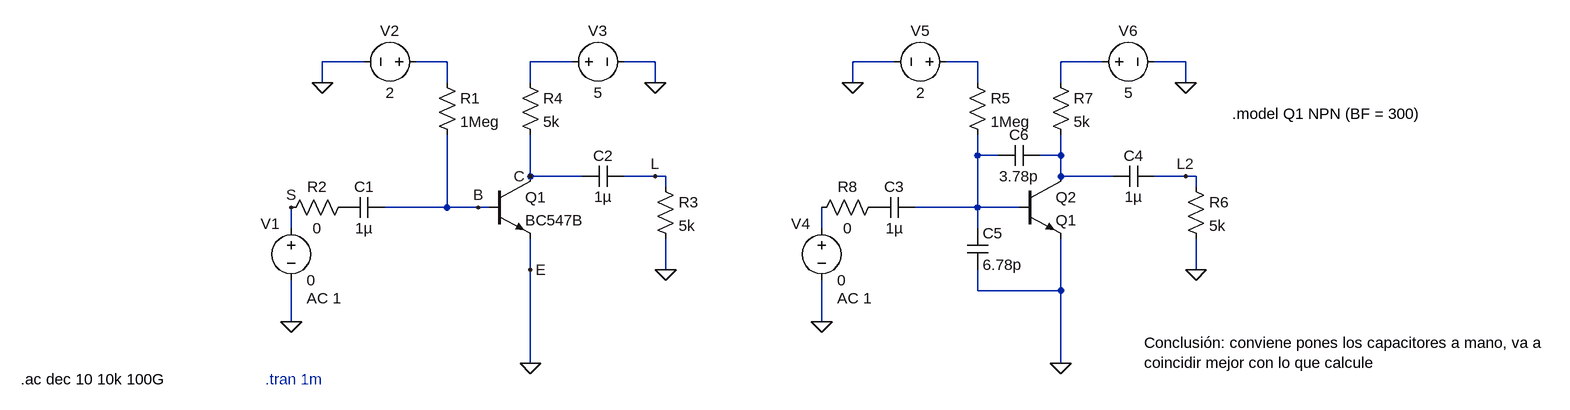
[diagram p0: schematic Simu en altas frec.asc]
Simu en altas frec.asc, the LTspice schematic file:
Version 4
SHEET 1 2168 680
WIRE 304 112 240 112
WIRE 432 112 384 112
WIRE 624 112 560 112
WIRE 752 112 704 112
WIRE 1120 112 1056 112
WIRE 1248 112 1200 112
WIRE 1440 112 1376 112
WIRE 1568 112 1520 112
WIRE 240 144 240 112
WIRE 432 144 432 112
WIRE 560 144 560 112
WIRE 752 144 752 112
WIRE 1056 144 1056 112
WIRE 1248 144 1248 112
WIRE 1376 144 1376 112
WIRE 1568 144 1568 112
WIRE 1248 256 1248 224
WIRE 1280 256 1248 256
WIRE 1376 256 1376 224
WIRE 1376 256 1344 256
WIRE 560 288 560 224
WIRE 640 288 560 288
WIRE 752 288 704 288
WIRE 768 288 752 288
WIRE 1376 288 1376 256
WIRE 1456 288 1376 288
WIRE 1568 288 1520 288
WIRE 1584 288 1568 288
WIRE 768 304 768 288
WIRE 1584 304 1584 288
WIRE 432 336 432 224
WIRE 432 336 336 336
WIRE 480 336 432 336
WIRE 496 336 480 336
WIRE 1248 336 1248 256
WIRE 1248 336 1152 336
WIRE 1312 336 1248 336
WIRE 192 368 192 336
WIRE 1008 368 1008 336
WIRE 1248 368 1248 336
WIRE 560 432 560 384
WIRE 768 432 768 384
WIRE 1584 432 1584 384
WIRE 1248 464 1248 432
WIRE 1376 464 1376 384
WIRE 1376 464 1248 464
WIRE 192 512 192 448
WIRE 1008 512 1008 448
WIRE 560 576 560 432
WIRE 1376 576 1376 464
FLAG 560 576 0
FLAG 768 432 0
FLAG 192 512 0
FLAG 240 144 0
FLAG 752 144 0
FLAG 480 336 B
FLAG 560 288 C
FLAG 560 432 E
FLAG 752 288 L
FLAG 192 336 S
FLAG 1376 576 0
FLAG 1584 432 0
FLAG 1008 512 0
FLAG 1056 144 0
FLAG 1568 144 0
FLAG 1568 288 L2
SYMBOL res 416 128 R0
SYMATTR InstName R1
SYMATTR Value 1Meg
SYMBOL res 752 288 R0
SYMATTR InstName R3
SYMATTR Value 5k
SYMBOL cap 336 320 R90
WINDOW 0 0 32 VBottom 2
WINDOW 3 32 32 VTop 2
SYMATTR InstName C1
SYMATTR Value 1µ
SYMBOL cap 704 272 R90
WINDOW 0 0 32 VBottom 2
WINDOW 3 32 32 VTop 2
SYMATTR InstName C2
SYMATTR Value 1µ
SYMBOL voltage 192 352 R0
WINDOW 0 -47 9 Left 2
WINDOW 123 24 124 Left 2
WINDOW 39 0 0 Left 0
SYMATTR InstName V1
SYMATTR Value2 AC 1
SYMATTR Value 0
SYMBOL voltage 400 112 R90
WINDOW 0 -32 56 VBottom 2
WINDOW 3 32 56 VTop 2
WINDOW 123 0 0 Left 0
WINDOW 39 0 0 Left 0
SYMATTR InstName V2
SYMATTR Value 2
SYMBOL voltage 608 112 R270
WINDOW 0 32 56 VTop 2
WINDOW 3 -32 56 VBottom 2
WINDOW 123 0 0 Left 0
WINDOW 39 0 0 Left 0
SYMATTR InstName V3
SYMATTR Value 5
SYMBOL res 544 128 R0
SYMATTR InstName R4
SYMATTR Value 5k
SYMBOL npn 496 288 R0
SYMATTR InstName Q1
SYMATTR Value BC547B
SYMBOL res 1232 128 R0
SYMATTR InstName R5
SYMATTR Value 1Meg
SYMBOL res 1568 288 R0
SYMATTR InstName R6
SYMATTR Value 5k
SYMBOL cap 1152 320 R90
WINDOW 0 0 32 VBottom 2
WINDOW 3 32 32 VTop 2
SYMATTR InstName C3
SYMATTR Value 1µ
SYMBOL cap 1520 272 R90
WINDOW 0 0 32 VBottom 2
WINDOW 3 32 32 VTop 2
SYMATTR InstName C4
SYMATTR Value 1µ
SYMBOL voltage 1008 352 R0
WINDOW 0 -47 9 Left 2
WINDOW 123 24 124 Left 2
WINDOW 39 0 0 Left 0
SYMATTR InstName V4
SYMATTR Value2 AC 1
SYMATTR Value 0
SYMBOL voltage 1216 112 R90
WINDOW 0 -32 56 VBottom 2
WINDOW 3 32 56 VTop 2
WINDOW 123 0 0 Left 0
WINDOW 39 0 0 Left 0
SYMATTR InstName V5
SYMATTR Value 2
SYMBOL voltage 1424 112 R270
WINDOW 0 32 56 VTop 2
WINDOW 3 -32 56 VBottom 2
WINDOW 123 0 0 Left 0
WINDOW 39 0 0 Left 0
SYMATTR InstName V6
SYMATTR Value 5
SYMBOL res 1360 128 R0
SYMATTR InstName R7
SYMATTR Value 5k
SYMBOL npn 1312 288 R0
SYMATTR InstName Q2
SYMATTR Value Q1
SYMBOL cap 1232 368 R0
SYMATTR InstName C5
SYMATTR Value 6.78p
SYMBOL cap 1344 240 R90
WINDOW 0 0 32 VBottom 2
WINDOW 3 32 32 VTop 2
SYMATTR InstName C6
SYMATTR Value 3.78p
SYMBOL res 288 320 R90
WINDOW 0 0 56 VBottom 2
WINDOW 3 32 56 VTop 2
SYMATTR InstName R2
SYMATTR Value 0
SYMBOL res 1104 320 R90
WINDOW 0 0 56 VBottom 2
WINDOW 3 32 56 VTop 2
SYMATTR InstName R8
SYMATTR Value 0
TEXT 152 600 Left 2 ;.tran 1m
TEXT -224 600 Left 2 !.ac dec 10 10k 100G
TEXT 1640 192 Left 2 !.model Q1 NPN (BF = 300)
TEXT 1504 544 Left 2 !Conclusión: conviene pones los capacitores a mano, va a \ncoincidir mejor con lo que calcule

The netlist it stands for:
* Simu en altas frec.asc
R1 N001 B 1Meg
R3 L 0 5k
C1 B P001 1µ
C2 L C 1µ
V1 S 0 0 AC 1
V2 N001 0 2
V3 N002 0 5
R4 N002 C 5k
Q1 C B 0 0 BC547B
R5 N003 N005 1Meg
R6 L2 0 5k
C3 N005 P002 1µ
C4 L2 N006 1µ
V4 N007 0 0 AC 1
V5 N003 0 2
V6 N004 0 5
R7 N004 N006 5k
Q2 N006 N005 0 0 Q1
C5 N005 0 6.78p
C6 N006 N005 3.78p
R2 P001 S 0
R8 P002 N007 0
.model NPN NPN
.model PNP PNP
.lib standard.bjt
* .tran 1m
.ac dec 10 10k 100G
.model Q1 NPN (BF = 300)
Conclusión: conviene pones los capacitores a mano, va a
coincidir mejor con lo que calcule
.backanno
.end